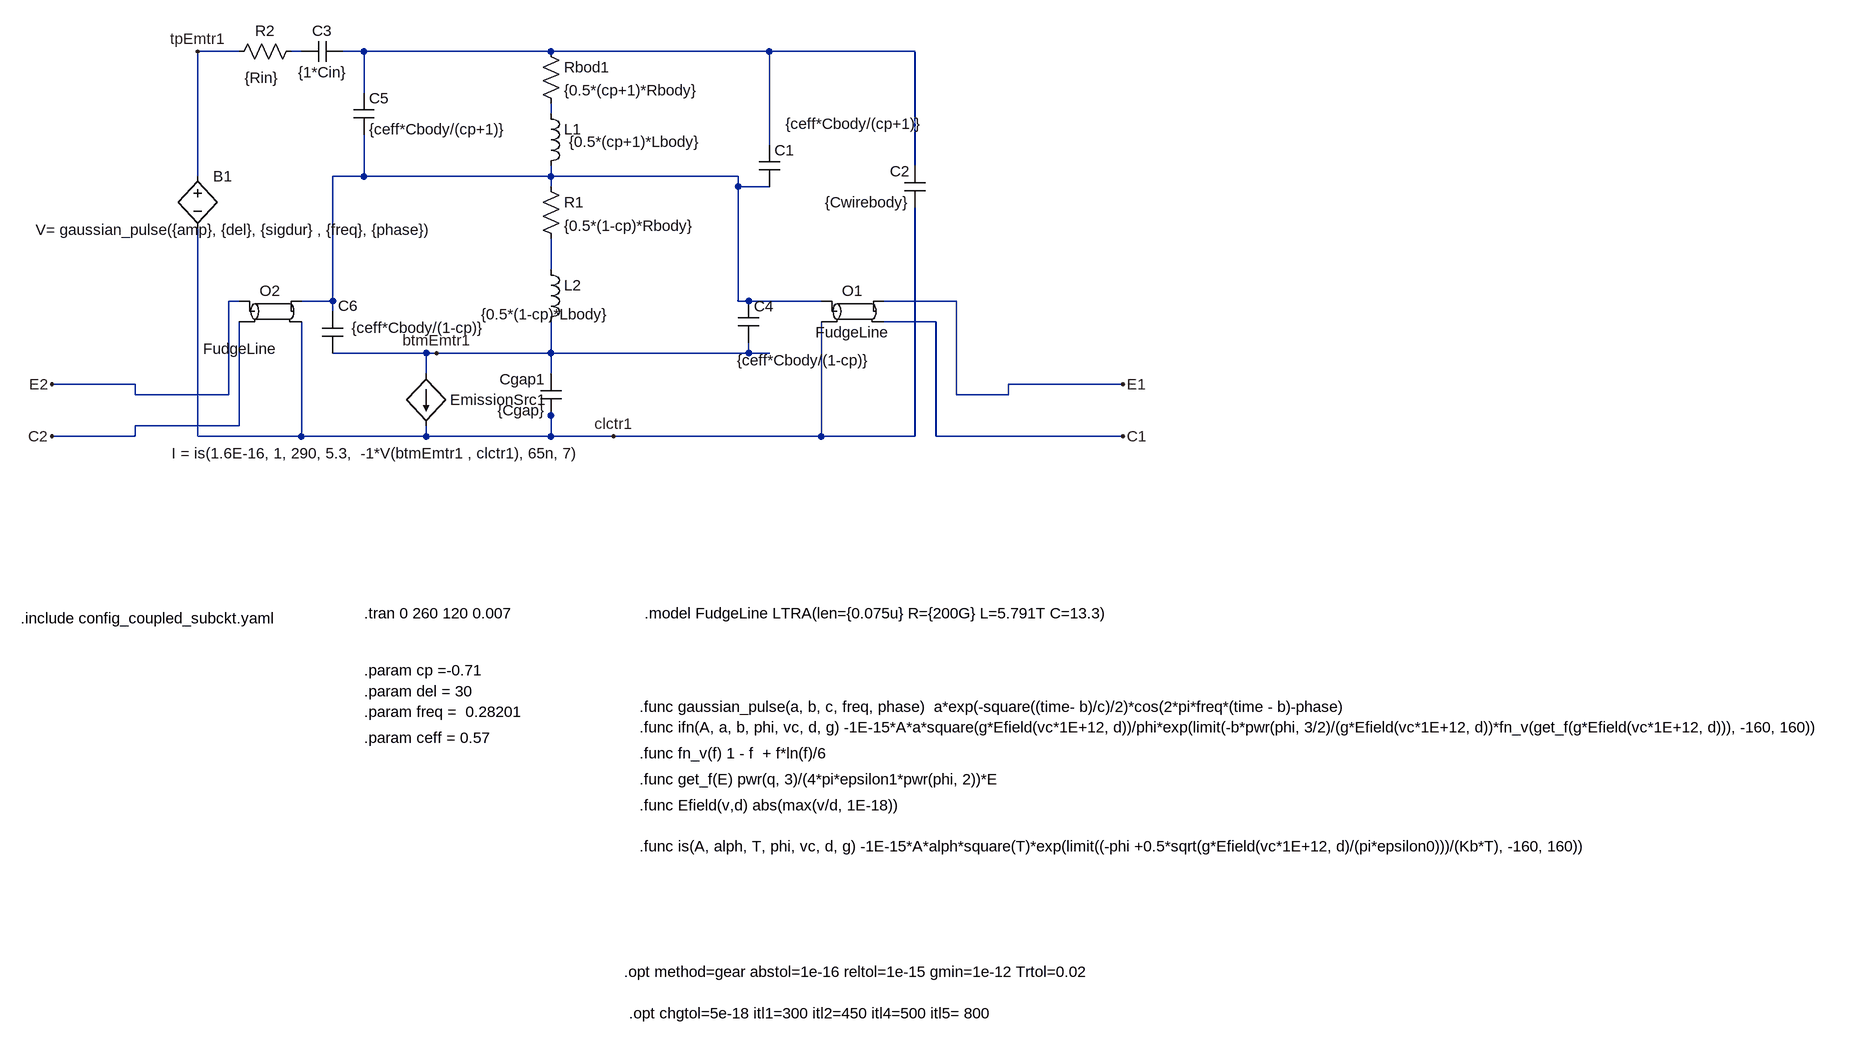
[diagram p0: schematic single_antenna_for_coupling.asc]
single_antenna_for_coupling.asc, the LTspice schematic file:
Version 4.1
SHEET 1 2732 1704
WIRE 16 -336 -48 -336
WIRE 112 -336 96 -336
WIRE 208 -336 176 -336
WIRE 496 -336 208 -336
WIRE 832 -336 496 -336
WIRE 1056 -336 832 -336
WIRE 208 -272 208 -336
WIRE 496 -240 496 -256
WIRE 832 -192 832 -336
WIRE 1056 -160 1056 -336
WIRE -48 -144 -48 -336
WIRE 208 -144 208 -208
WIRE 208 -144 160 -144
WIRE 496 -144 496 -160
WIRE 496 -144 208 -144
WIRE 784 -144 496 -144
WIRE 496 -128 496 -144
WIRE 784 -128 784 -144
WIRE 832 -128 784 -128
WIRE 496 0 496 -48
WIRE 16 48 0 48
WIRE 160 48 160 -144
WIRE 160 48 112 48
WIRE 784 48 784 -128
WIRE 800 48 784 48
WIRE 912 48 800 48
WIRE 1120 48 1008 48
WIRE 160 64 160 48
WIRE 1088 80 1008 80
WIRE 304 128 160 128
WIRE 320 128 304 128
WIRE 496 128 496 80
WIRE 496 128 320 128
WIRE 800 128 800 112
WIRE 800 128 496 128
WIRE 832 128 800 128
WIRE 304 160 304 128
WIRE 496 160 496 128
WIRE -144 176 -272 176
WIRE 1376 176 1200 176
WIRE -144 192 -144 176
WIRE 0 192 0 48
WIRE 0 192 -144 192
WIRE 1120 192 1120 48
WIRE 1200 192 1200 176
WIRE 1200 192 1120 192
WIRE 496 224 496 208
WIRE 16 240 16 80
WIRE 16 240 -144 240
WIRE -144 256 -144 240
WIRE -144 256 -272 256
WIRE -48 256 -48 -64
WIRE 112 256 112 80
WIRE 112 256 -48 256
WIRE 304 256 304 240
WIRE 304 256 112 256
WIRE 496 256 496 224
WIRE 496 256 304 256
WIRE 592 256 496 256
WIRE 912 256 912 80
WIRE 912 256 592 256
WIRE 1056 256 1056 -96
WIRE 1056 256 912 256
WIRE 1088 256 1088 80
WIRE 1376 256 1088 256
FLAG 320 128 btmEmtr1
FLAG 592 256 clctr1
FLAG -48 -336 tpEmtr1
FLAG -272 176 E2
FLAG -272 256 C2
FLAG 1376 176 E1
FLAG 1376 256 C1
SYMBOL cap 816 -192 R0
WINDOW 3 41 -33 Left 2
SYMATTR Value {ceff*Cbody/(cp+1)}
SYMATTR InstName C1
SYMBOL cap 512 224 R180
WINDOW 0 24 56 Left 2
WINDOW 3 24 8 Left 2
SYMATTR InstName Cgap1
SYMATTR Value {Cgap}
SYMBOL cap 1072 -96 R180
WINDOW 0 24 56 Left 2
WINDOW 3 24 8 Left 2
SYMATTR InstName C2
SYMATTR Value {Cwirebody}
SYMBOL res 480 -352 R0
SYMATTR InstName Rbod1
SYMATTR Value {0.5*(cp+1)*Rbody}
SYMBOL res 480 -144 R0
SYMATTR InstName R1
SYMATTR Value {0.5*(1-cp)*Rbody}
SYMBOL ind 480 -256 R0
WINDOW 3 44 59 Left 2
SYMATTR Value {0.5*(cp+1)*Lbody}
SYMATTR InstName L1
SYMBOL ind 480 -16 R0
WINDOW 3 -92 84 Left 2
SYMATTR Value {0.5*(1-cp)*Lbody}
SYMATTR InstName L2
SYMBOL res 112 -352 R90
WINDOW 0 0 56 VBottom 2
WINDOW 3 41 61 VTop 2
SYMATTR InstName R2
SYMATTR Value {Rin}
SYMBOL cap 176 -352 R90
WINDOW 0 0 32 VBottom 2
WINDOW 3 32 32 VTop 2
SYMATTR InstName C3
SYMATTR Value {1*Cin}
SYMBOL cap 784 48 R0
WINDOW 3 -2 91 Left 2
SYMATTR Value {ceff*Cbody/(1-cp)}
SYMATTR InstName C4
SYMBOL cap 192 -272 R0
SYMATTR InstName C5
SYMATTR Value {ceff*Cbody/(cp+1)}
SYMBOL cap 144 64 R0
WINDOW 0 24 -9 Left 2
WINDOW 3 45 25 Left 2
SYMATTR InstName C6
SYMATTR Value {ceff*Cbody/(1-cp)}
SYMBOL ltline 960 64 R0
SYMATTR InstName O1
SYMATTR Value FudgeLine
SYMBOL ltline 64 64 R0
WINDOW 3 -46 42 Top 2
SYMATTR Value FudgeLine
SYMATTR InstName O2
SYMBOL bv -48 -160 R0
WINDOW 3 -249 98 Left 2
SYMATTR Value V= gaussian_pulse({amp}, {del}, {sigdur} , {freq}, {phase})
SYMATTR InstName B1
SYMBOL bi 304 160 R0
WINDOW 3 -392 122 Left 2
WINDOW 0 37 40 Left 2
SYMATTR Value I = is(1.6E-16, 1, 290, 5.3,  -1*V(btmEmtr1 , clctr1), 65n, 7)
SYMATTR InstName EmissionSrc1
TEXT -320 536 Left 2 !.include config_coupled_subckt.yaml
TEXT 208 528 Left 2 !.tran 0 260 120 0.007
TEXT 208 616 Left 2 !.param cp =-0.71
TEXT 632 672 Left 2 !.func gaussian_pulse(a, b, c, freq, phase)  a*exp(-square((time- b)/c)/2)*cos(2*pi*freq*(time - b)-phase)
TEXT 208 648 Left 2 !.param del = 30
TEXT 208 680 Left 2 !.param freq =  0.28201
TEXT 640 528 Left 2 !.model FudgeLine LTRA(len={0.075u} R={200G} L=5.791T C=13.3)
TEXT 208 720 Left 2 !.param ceff = 0.57
TEXT 632 744 Left 2 !.func fn_v(f) 1 - f  + f*ln(f)/6
TEXT 632 784 Left 2 !.func get_f(E) pwr(q, 3)/(4*pi*epsilon1*pwr(phi, 2))*E
TEXT 632 704 Left 2 !.func ifn(A, a, b, phi, vc, d, g) -1E-15*A*a*square(g*Efield(vc*1E+12, d))/phi*exp(limit(-b*pwr(phi, 3/2)/(g*Efield(vc*1E+12, d))*fn_v(get_f(g*Efield(vc*1E+12, d))), -160, 160))
TEXT 632 824 Left 2 !.func Efield(v,d) abs(max(v/d, 1E-18))\n \n.func is(A, alph, T, phi, vc, d, g) -1E-15*A*alph*square(T)*exp(limit((-phi +0.5*sqrt(g*Efield(vc*1E+12, d)/(pi*epsilon0)))/(Kb*T), -160, 160))
TEXT 608 1080 Left 2 !.opt method=gear abstol=1e-16 reltol=1e-15 gmin=1e-12 Trtol=0.02
TEXT 616 1144 Left 2 !.opt chgtol=5e-18 itl1=300 itl2=450 itl4=500 itl5= 800

The netlist it stands for:
* single_antenna_for_coupling.asc
C1 N002 N004 {ceff*Cbody/(cp+1)}
Cgap1 clctr1 btmEmtr1 {Cgap}
C2 clctr1 N002 {Cwirebody}
Rbod1 N002 N003 {0.5*(cp+1)*Rbody}
R1 N004 N005 {0.5*(1-cp)*Rbody}
L1 N003 N004 {0.5*(cp+1)*Lbody}
L2 N005 btmEmtr1 {0.5*(1-cp)*Lbody}
R2 N001 tpEmtr1 {Rin}
C3 N002 N001 {1*Cin}
C4 N004 btmEmtr1 {ceff*Cbody/(1-cp)}
C5 N002 N004 {ceff*Cbody/(cp+1)}
C6 N004 btmEmtr1 {ceff*Cbody/(1-cp)}
O1 N004 clctr1 E1 C1 FudgeLine
O2 E2 C2 N004 clctr1 FudgeLine
B1 tpEmtr1 clctr1 V= gaussian_pulse({amp}, {del}, {sigdur} , {freq}, {phase})
B§EmissionSrc1 btmEmtr1 clctr1 I = is(1.6E-16, 1, 290, 5.3,  -1*V(btmEmtr1 , clctr1), 65n, 7)
.include config_coupled_subckt.yaml
.tran 0 260 120 0.007
.param cp =-0.71
.func gaussian_pulse(a, b, c, freq, phase)  a*exp(-square((time- b)/c)/2)*cos(2*pi*freq*(time - b)-phase)
.param del = 30
.param freq =  0.28201
.model FudgeLine LTRA(len={0.075u} R={200G} L=5.791T C=13.3)
.param ceff = 0.57
.func fn_v(f) 1 - f  + f*ln(f)/6
.func get_f(E) pwr(q, 3)/(4*pi*epsilon1*pwr(phi, 2))*E
.func ifn(A, a, b, phi, vc, d, g) -1E-15*A*a*square(g*Efield(vc*1E+12, d))/phi*exp(limit(-b*pwr(phi, 3/2)/(g*Efield(vc*1E+12, d))*fn_v(get_f(g*Efield(vc*1E+12, d))), -160, 160))
.func Efield(v,d) abs(max(v/d, 1E-18))
.func is(A, alph, T, phi, vc, d, g) -1E-15*A*alph*square(T)*exp(limit((-phi +0.5*sqrt(g*Efield(vc*1E+12, d)/(pi*epsilon0)))/(Kb*T), -160, 160))
.opt method=gear abstol=1e-16 reltol=1e-15 gmin=1e-12 Trtol=0.02
.opt chgtol=5e-18 itl1=300 itl2=450 itl4=500 itl5= 800
.backanno
.end